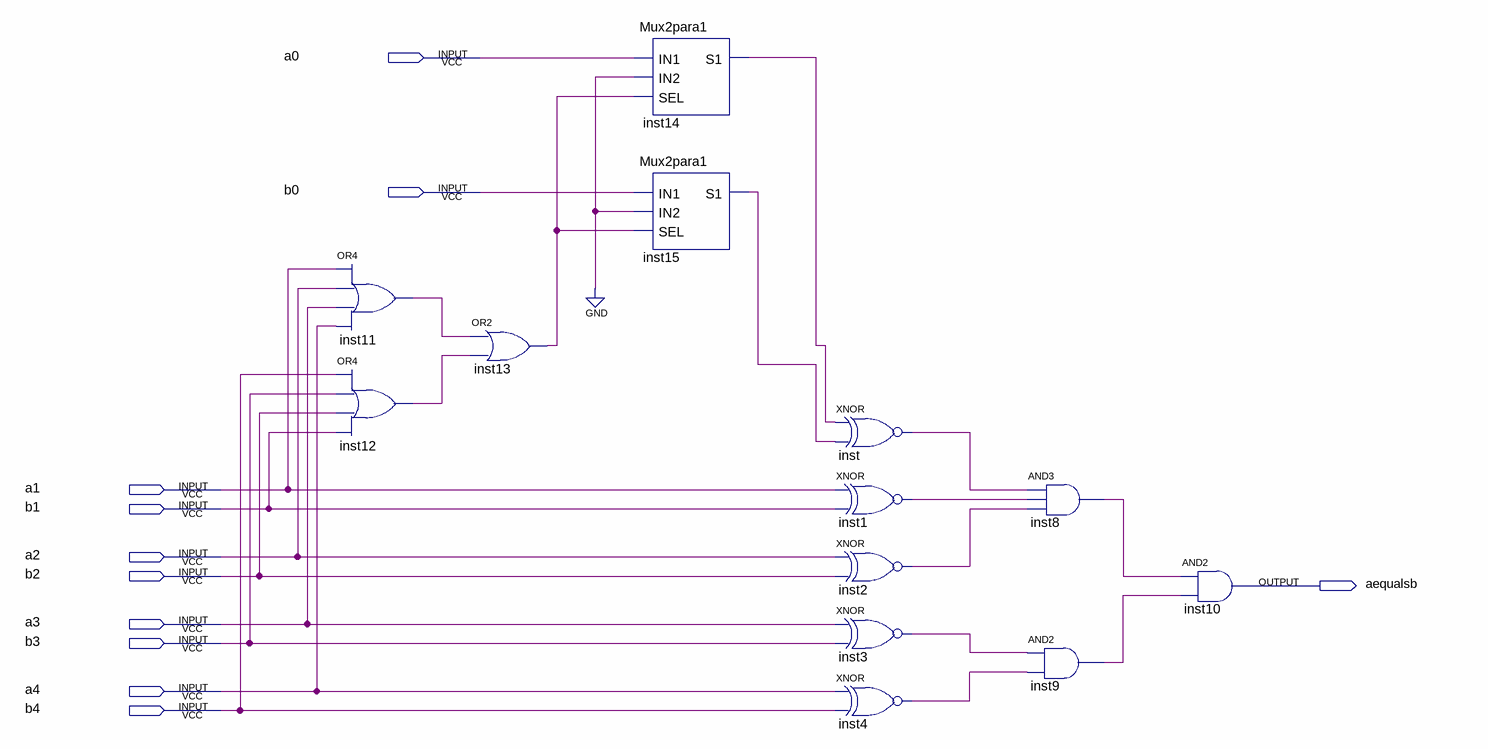
[diagram p0: schematic sheet]
// Quartus schematic aequalsb.bdf as structural Verilog: 13 symbols, 11 pins
module aequalsb (
  input  a0,
  input  b0,
  input  a1,
  input  b1,
  input  a2,
  input  b2,
  input  a3,
  input  b3,
  input  a4,
  input  b4,
  output aequalsb
);

  wire inst1_out, inst2_out, inst3_out, inst4_out, inst8_out, inst9_out, inst11_out, inst12_out, inst13_out,
       inst14_s1, inst15_s1, inst_out;

  or inst11 (inst11_out, a1, a2, a3, a4);
  or inst12 (inst12_out, b4, b3, b2, b1);
  or inst13 (inst13_out, inst11_out, inst12_out);
  Mux2para1 inst14 (.IN1(a0), .IN2(1'b0), .SEL(inst13_out), .S1(inst14_s1));
  Mux2para1 inst15 (.IN1(b0), .IN2(1'b0), .SEL(inst13_out), .S1(inst15_s1));
  xnor inst (inst_out, inst14_s1, inst15_s1);
  xnor inst1 (inst1_out, a1, b1);
  xnor inst2 (inst2_out, a2, b2);
  xnor inst3 (inst3_out, a3, b3);
  xnor inst4 (inst4_out, a4, b4);
  and inst8 (inst8_out, inst_out, inst1_out, inst2_out);
  and inst9 (inst9_out, inst3_out, inst4_out);
  and inst10 (aequalsb, inst8_out, inst9_out);
endmodule
